# Altium project TAUV-Regulated_Power.PrjPcb (part 2 of 2)

## Sheet Sht3-V12P0_reg.SchDoc
size C; SheetNumber: 3; SheetTotal: 4
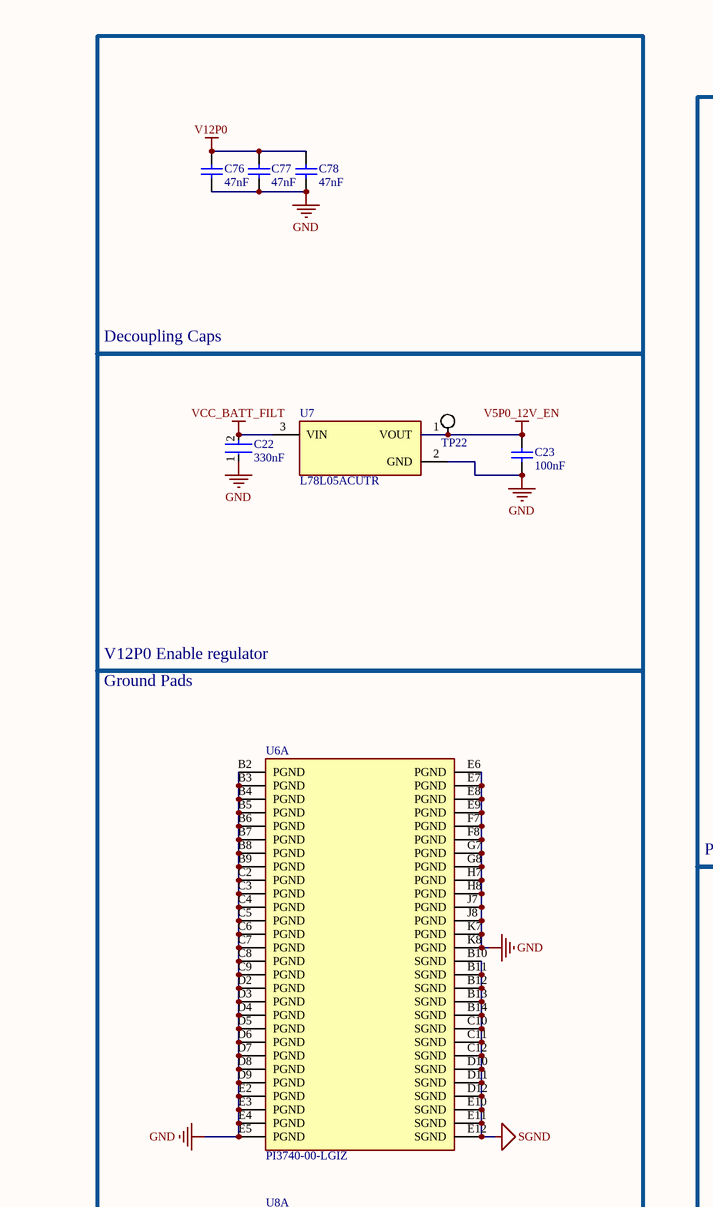
[diagram p5: Sht3-V12P0_reg.SchDoc, top left]
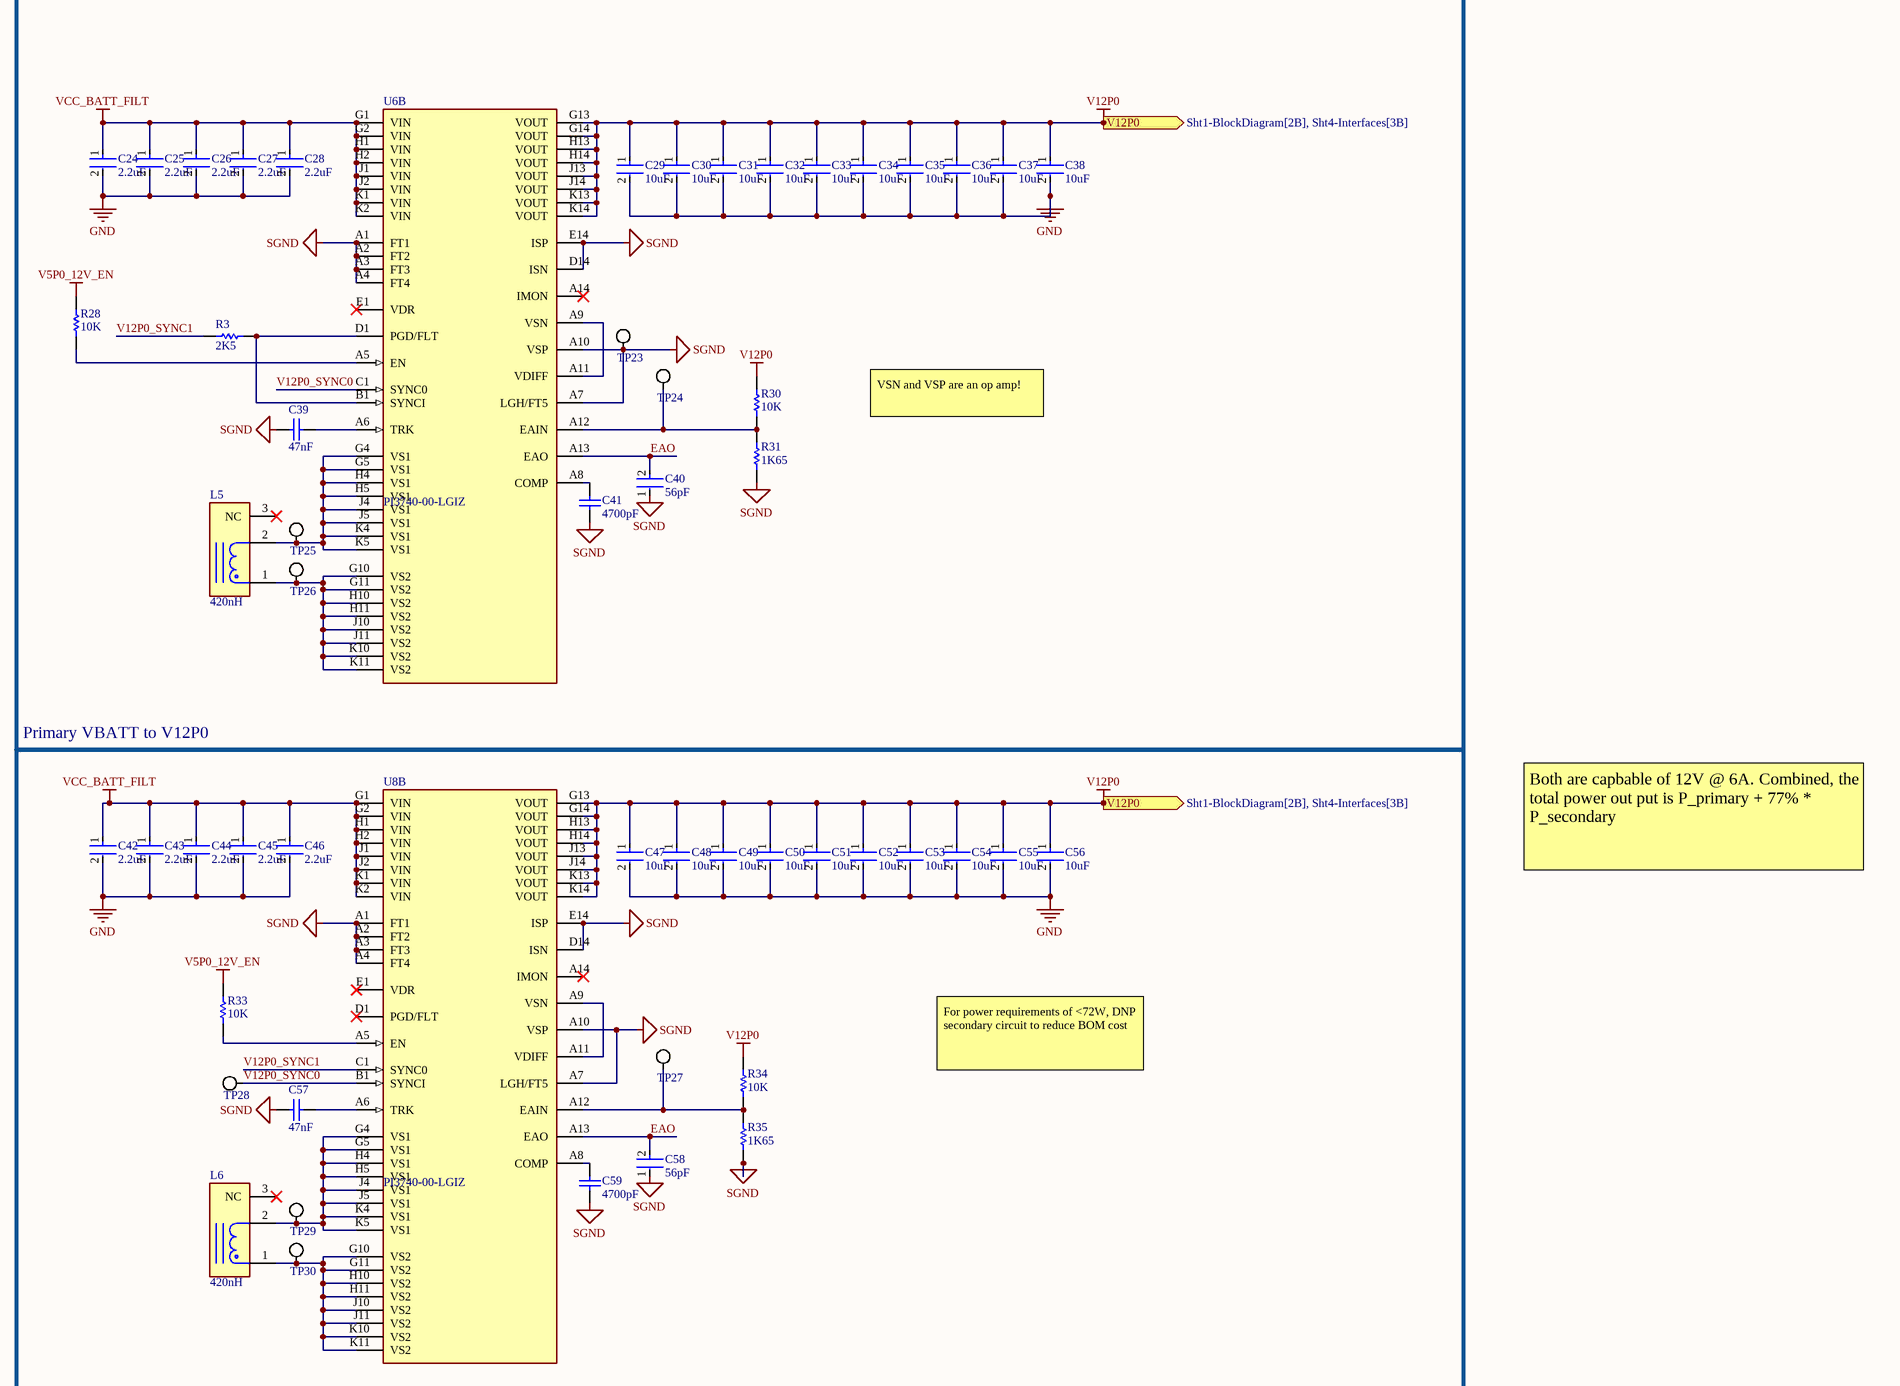
[diagram p6: Sht3-V12P0_reg.SchDoc, top right]
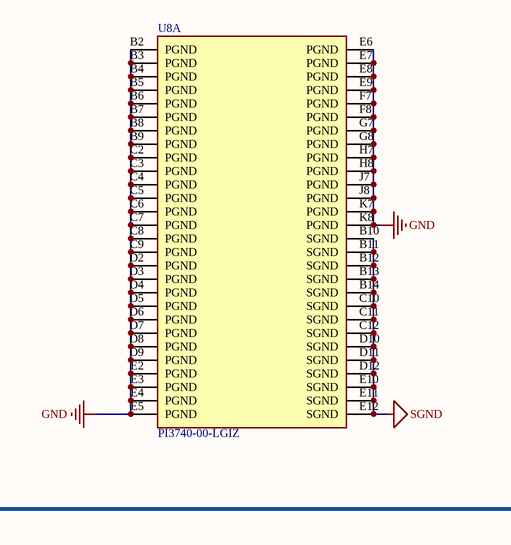
[diagram p7: Sht3-V12P0_reg.SchDoc, bottom left]
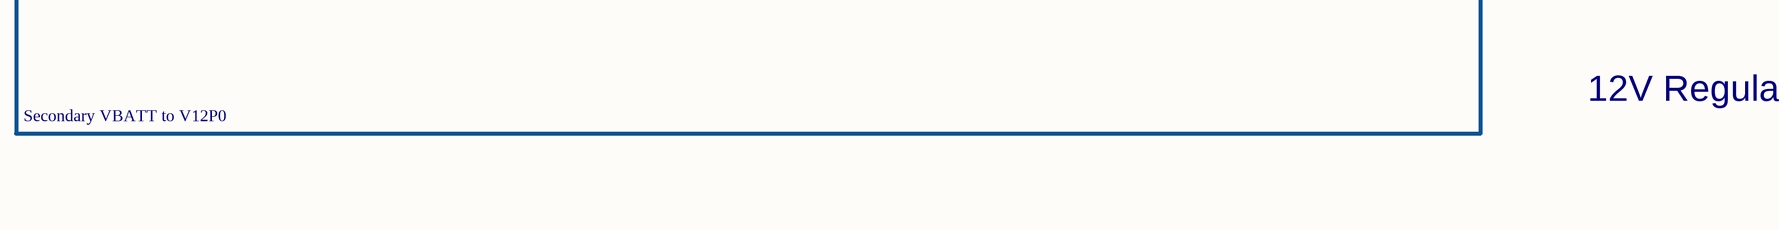
[diagram p8: Sht3-V12P0_reg.SchDoc, bottom right]

### Parts
C22  330nF  [FP-C1608-080-0_1-IPC_A]
C23  100nF  [CAPC0603(1608)100_L]
C24  2.2uF  [FP-1210-L_3_3_0_4-W_2_5_0-IPC_B]
C25  2.2uF  [FP-1210-L_3_3_0_4-W_2_5_0-IPC_B]
C26  2.2uF  [FP-1210-L_3_3_0_4-W_2_5_0-IPC_B]
C27  2.2uF  [FP-1210-L_3_3_0_4-W_2_5_0-IPC_B]
C28  2.2uF  [FP-1210-L_3_3_0_4-W_2_5_0-IPC_B]
C29  10uF  [FP-GRM32-MFG]
C30  10uF  [FP-GRM32-MFG]
C31  10uF  [FP-GRM32-MFG]
C32  10uF  [FP-GRM32-MFG]
C33  10uF  [FP-GRM32-MFG]
C34  10uF  [FP-GRM32-MFG]
C35  10uF  [FP-GRM32-MFG]
C36  10uF  [FP-GRM32-MFG]
C37  10uF  [FP-GRM32-MFG]
C38  10uF  [FP-GRM32-MFG]
C39  47nF  [CAPC1608X90X35LL10T15]
C40  56pF  [FP-C1608-080-0_1-IPC_C]
C41  4700pF  [CAPC1608X90X35ML10T15]
C42  2.2uF  [FP-1210-L_3_3_0_4-W_2_5_0-IPC_B]
C43  2.2uF  [FP-1210-L_3_3_0_4-W_2_5_0-IPC_B]
C44  2.2uF  [FP-1210-L_3_3_0_4-W_2_5_0-IPC_B]
C45  2.2uF  [FP-1210-L_3_3_0_4-W_2_5_0-IPC_B]
C46  2.2uF  [FP-1210-L_3_3_0_4-W_2_5_0-IPC_B]
C47  10uF  [FP-GRM32-MFG]
C48  10uF  [FP-GRM32-MFG]
C49  10uF  [FP-GRM32-MFG]
C50  10uF  [FP-GRM32-MFG]
C51  10uF  [FP-GRM32-MFG]
C52  10uF  [FP-GRM32-MFG]
C53  10uF  [FP-GRM32-MFG]
C54  10uF  [FP-GRM32-MFG]
C55  10uF  [FP-GRM32-MFG]
C56  10uF  [FP-GRM32-MFG]
C57  47nF  [CAPC1608X90X35LL10T15]
C58  56pF  [FP-C1608-080-0_1-IPC_C]
C59  4700pF  [CAPC1608X90X35ML10T15]
C76  47nF  [CAPC1608X90X35LL10T15]
C77  47nF  [CAPC1608X90X35LL10T15]
C78  47nF  [CAPC1608X90X35LL10T15]
L5  420nH  [FP-HCV1206-R42-R-MFG]
L6  420nH  [FP-HCV1206-R42-R-MFG]
R3  2K5  [RESC1608X55X25NL10T15]
R28  10K  [RESC1609X50X30NL8T20]
R30  10K  [RESC1609X50X30NL8T20]
R31  1K65  [RESC1608X55X25ML10T15]
R33  10K  [RESC1609X50X30NL8T20]
R34  10K  [RESC1609X50X30NL8T20]
R35  1K65  [RESC1608X55X25ML10T15]
TP22  (no value)  [Test Point Pad]
TP23  (no value)  [Test Point Pad]
TP24  (no value)  [Test Point Pad]
TP25  (no value)  [Test Point Pad]
TP26  (no value)  [Test Point Pad]
TP27  (no value)  [Test Point Pad]
TP28  (no value)  [Test Point Pad]
TP29  (no value)  [Test Point Pad]
TP30  (no value)  [Test Point Pad]
U6  PI3740-00-LGIZ  [FP-PI3740-00-LGIZ-MFG]  (parts A,B of 2)
U7  L78L05ACUTR  [FP-SOT-89-7098166-MFG]
U8  PI3740-00-LGIZ  [FP-PI3740-00-LGIZ-MFG]  (parts A,B of 2)

### Blocks framed on the sheet
Decoupling Caps: C76-C78
Primary VBATT to V12P0: C24-C41 L5 R3 R28 R30 R31 TP23-TP26 U6
Secondary VBATT to V12P0: C42-C59 L6 R33-R35 TP27-TP30 U8

### Ports
V12P0 (out, see Sht1-BlockDiagram[2B], Sht4-Interfaces[3B])

### Nets
GND: C22.1 C23.2 C24.2 C25.2 C26.2 C27.2 C28.2 C29.2 C30.2 C31.2 C32.2 C33.2 C34.2 C35.2 C36.2 C37.2 C38.2 C42.2 C43.2 C44.2 C45.2 C46.2 C47.2 C48.2 C49.2 C50.2 C51.2 C52.2 C53.2 C54.2 C55.2 C56.2 C76.2 C77.2 C78.2 U6.B2(PGND) U6.B3(PGND) U6.B4(PGND) U6.B5(PGND) U6.B6(PGND) U6.B7(PGND) U6.B8(PGND) U6.B9(PGND) U6.C2(PGND) U6.C3(PGND) U6.C4(PGND) U6.C5(PGND) U6.C6(PGND) U6.C7(PGND) U6.C8(PGND) U6.C9(PGND) U6.D2(PGND) U6.D3(PGND) U6.D4(PGND) U6.D5(PGND) U6.D6(PGND) U6.D7(PGND) U6.D8(PGND) U6.D9(PGND) U6.E2(PGND) U6.E3(PGND) U6.E4(PGND) U6.E5(PGND) U6.E6(PGND) U6.E7(PGND) U6.E8(PGND) U6.E9(PGND) U6.F7(PGND) U6.F8(PGND) U6.G7(PGND) U6.G8(PGND) U6.H7(PGND) U6.H8(PGND) U6.J7(PGND) U6.J8(PGND) U6.K7(PGND) U6.K8(PGND) U7.2(GND) U8.B2(PGND) U8.B3(PGND) U8.B4(PGND) U8.B5(PGND) U8.B6(PGND) U8.B7(PGND) U8.B8(PGND) U8.B9(PGND) U8.C2(PGND) U8.C3(PGND) U8.C4(PGND) U8.C5(PGND) U8.C6(PGND) U8.C7(PGND) U8.C8(PGND) U8.C9(PGND) U8.D2(PGND) U8.D3(PGND) U8.D4(PGND) U8.D5(PGND) U8.D6(PGND) U8.D7(PGND) U8.D8(PGND) U8.D9(PGND) U8.E2(PGND) U8.E3(PGND) U8.E4(PGND) U8.E5(PGND) U8.E6(PGND) U8.E7(PGND) U8.E8(PGND) U8.E9(PGND) U8.F7(PGND) U8.F8(PGND) U8.G7(PGND) U8.G8(PGND) U8.H7(PGND) U8.H8(PGND) U8.J7(PGND) U8.J8(PGND) U8.K7(PGND) U8.K8(PGND)
SGND: C39.2 C40.1 C41.2 C57.1 C58.1 C59.2 R31.1 R35.1 TP23.1 U6.A1(FT1) U6.A2(FT2) U6.A3(FT3) U6.A4(FT4) U6.A7(LGH/FT5) U6.A10(VSP) U6.B10(SGND) U6.B11(SGND) U6.B12(SGND) U6.B13(SGND) U6.B14(SGND) U6.C10(SGND) U6.C11(SGND) U6.C12(SGND) U6.D10(SGND) U6.D11(SGND) U6.D12(SGND) U6.D14(ISN) U6.E10(SGND) U6.E11(SGND) U6.E12(SGND) U6.E14(ISP) U8.A1(FT1) U8.A2(FT2) U8.A3(FT3) U8.A4(FT4) U8.A7(LGH/FT5) U8.A10(VSP) U8.B10(SGND) U8.B11(SGND) U8.B12(SGND) U8.B13(SGND) U8.B14(SGND) U8.C10(SGND) U8.C11(SGND) U8.C12(SGND) U8.D10(SGND) U8.D11(SGND) U8.D12(SGND) U8.D14(ISN) U8.E10(SGND) U8.E11(SGND) U8.E12(SGND) U8.E14(ISP)
V5P0_12V_EN: C23.1 R28.2 R33.2 TP22.1 U7.1(VOUT)
V12P0: C29.1 C30.1 C31.1 C32.1 C33.1 C34.1 C35.1 C36.1 C37.1 C38.1 C47.1 C48.1 C49.1 C50.1 C51.1 C52.1 C53.1 C54.1 C55.1 C56.1 C76.1 C77.1 C78.1 R30.2 R34.2 U6.G13(VOUT) U6.G14(VOUT) U6.H13(VOUT) U6.H14(VOUT) U6.J13(VOUT) U6.J14(VOUT) U6.K13(VOUT) U6.K14(VOUT) U8.G13(VOUT) U8.G14(VOUT) U8.H13(VOUT) U8.H14(VOUT) U8.J13(VOUT) U8.J14(VOUT) U8.K13(VOUT) U8.K14(VOUT) ; port V12P0
VCC_BATT_FILT: C22.2 C24.1 C25.1 C26.1 C27.1 C28.1 C42.1 C43.1 C44.1 C45.1 C46.1 U6.G1(VIN) U6.G2(VIN) U6.H1(VIN) U6.H2(VIN) U6.J1(VIN) U6.J2(VIN) U6.K1(VIN) U6.K2(VIN) U7.3(VIN) U8.G1(VIN) U8.G2(VIN) U8.H1(VIN) U8.H2(VIN) U8.J1(VIN) U8.J2(VIN) U8.K1(VIN) U8.K2(VIN)
EAO: C40.2 C58.2 U6.A13(EAO) U8.A13(EAO)
V12P0_SYNC0: TP28.1 U6.C1(SYNC0) U8.B1(SYNCI)
V12P0_SYNC1: R3.1 U8.C1(SYNC0)
NetC39_1: C39.1 U6.A6(TRK)
NetC41_1: C41.1 U6.A8(COMP)
NetC57_2: C57.2 U8.A6(TRK)
NetC59_1: C59.1 U8.A8(COMP)
NetL5_1: L5.1 TP26.1 U6.G10(VS2) U6.G11(VS2) U6.H10(VS2) U6.H11(VS2) U6.J10(VS2) U6.J11(VS2) U6.K10(VS2) U6.K11(VS2)
NetL5_2: L5.2 TP25.1 U6.G4(VS1) U6.G5(VS1) U6.H4(VS1) U6.H5(VS1) U6.J4(VS1) U6.J5(VS1) U6.K4(VS1) U6.K5(VS1)
NetL6_1: L6.1 TP30.1 U8.G10(VS2) U8.G11(VS2) U8.H10(VS2) U8.H11(VS2) U8.J10(VS2) U8.J11(VS2) U8.K10(VS2) U8.K11(VS2)
NetL6_2: L6.2 TP29.1 U8.G4(VS1) U8.G5(VS1) U8.H4(VS1) U8.H5(VS1) U8.J4(VS1) U8.J5(VS1) U8.K4(VS1) U8.K5(VS1)
NetR3_2: R3.2 U6.B1(SYNCI) U6.D1(PGD/FLT)
NetR28_1: R28.1 U6.A5(EN)
NetR30_1: R30.1 R31.2 TP24.1 U6.A12(EAIN)
NetR33_1: R33.1 U8.A5(EN)
NetR34_1: R34.1 R35.2 TP27.1 U8.A12(EAIN)
NetU6_A9: U6.A9(VSN) U6.A11(VDIFF)
NetU8_A9: U8.A9(VSN) U8.A11(VDIFF)

Not connected (* = marked no-connect by the designer): L5 3(NC)*; L6 3(NC)*; U6 A14(IMON)* E1(VDR)*; U8 A14(IMON)* D1(PGD/FLT)* E1(VDR)*

### Notes on the sheet
- VSN and VSP are an op amp!
- V12P0 Enable regulator
- Ground Pads
- Both are capbable of 12V @ 6A. Combined, the total power out put is P_primary + 77% * P_secondary
- For power requirements of <72W, DNP secondary circuit to reduce BOM cost
- 12V Regulators

### Library data of the parts
C22 = 330nF 0603: Multilayer Ceramic Capacitors 330nF ±10% 50V X7R SMD 0603; Capacitance: 330nF; Case Code (Imperial): 0603; Case Code (Metric): 1608; Dielectric: X7R; Length: 1.6mm; Construction: Flat; Resistor Type: Ceramic; Mount: Surface Mount; Voltage Rating: 50V; Packaging: Tape and Reel; Series: C; Case/Package: 0603; Lead Free: Lead Free; Tolerance: 10%; Voltage: 50V; REACH SVHC: No SVHC; Height: 0.8mm; Weight: 7.1E-05oz; Termination: SMD/SMT; Max Operating Temperature: 125°C; RoHS Compliant: Yes; Min Operating Temperature: -55°C; Depth: 0.8mm; Package Quantity: 1; Thickness: 0.037inch; Voltage Rating (DC): 50V; Dielectric Material: Ceramic; Width: 0.031inch; ComponentLink1Description: Link; ComponentLink1URL: https://www.digikey.com/en/products/detail/tdk-corporation/C1608X7R1H334K080AC/2443428
C23 = 100nF 0603: CAP 100nF 100V ±10% 0603 (1608 Metric) Thickness 1mm SMD; Tolerance: Â±10%; Case-EIA: 0603; Case-Metric: 1608; Rated Voltage: 100 V; Value: 100nF; Technology: SMT; Max Thickness: 1 mm; ComponentLink1Description: Link; ComponentLink1URL: https://www.digikey.com/en/products/detail/samsung-electro-mechanics/CL10B104KC8NNNC/5961291
C24-C28 C42-C46 = 2.2uF 1210: General Purpose Ceramic Capacitor, 1210, 2.2uF, 10%, X7R, 15%, 100V; Dissipation Factor: 2.5%; Number of Pins: 2; Lead Free: Lead Free; Voltage Rating: 100V; Min Operating Temperature: -55°C; Height: 2.79mm; Length: 3.2mm; Capacitance: 2.2uF; RoHS Compliant: Yes; Case/Package: 1210; Max Operating Temperature: 125°C; Radiation Hardening: No; Series: -; Case Code (Metric): 3225; Dielectric: X7R; Voltage Rating (DC): 100V; Packaging: Tape and Reel; Width: 2.5mm; Thickness: 0.11inch; Depth: 2.5mm; Contact Plating: Tin; REACH SVHC: No SVHC; Tolerance: 10%; Construction: Flat; Case Code (Imperial): 1210; Mount: Surface Mount; Package Quantity: 1; Termination: SMD/SMT; Voltage: 100V; ComponentLink1Description: Link; ComponentLink1URL: https://www.digikey.com/en/products/detail/samsung-electro-mechanics/CL32B225KCJSNNE/3889020
C29-C38 C47-C56 = 10uF 1210: CAP CER 10UF 50V X7R 1210; Manufacturer Part Number: GRM32ER71H106KA12L; Manufacturer: Murata; Tolerance: 10%; Material: Ceramic; Temperature Coefficient: 15%; Voltage Rating: 50V; Temperature Characteristic: X7R; Value: 10uF; ComponentLink2Description: Datasheet; Device Class L1: Passive Components; Lead Free: Yes; Temperature Range High: +125°C; Category: Cap; ComponentLink2URL: https://search.murata.co.jp/Ceramy/image/img/A01X/G101/ENG/GRM32ER71H106KA12-01.pdf; Device Class L2: Capacitors; Package: GRM32; Mouser Description: 1210 10 uF 50 V ±10% Tolerance X7R SMT Multilayer Ceramic Capacitor; Capacitance: 10uF; Octopart: https://octopart.com/grm32er71h106ka12l-murata-10470987; Digikey Description: CAP CER 10UF 50V X7R 1210; Height: 2.7mm; Temperature: -55°C to +125°C; Temperature Range Low: -55°C; RoHS: TRUE; Device Class L3: Ceramic Capacitors; Automotive: No; ComponentLink3Description: Link; ComponentLink3URL: https://www.digikey.com/en/products/detail/samsung-electro-mechanics/CL32B106KBJNNNE/3889045
C39 C57 C76-C78 = 47nF 0603: Manufacturer: Murata; Part Number: GRM188R71E473KA01D; ComponentLink1Description: Link; ComponentLink1URL: https://www.digikey.com/en/products/detail/kemet/C0603X473J4RECAUTO7411/8654446
C40 C58 = 56pF 0603: Multilayer Ceramic Capacitors 56pF ±5% 50V C0G SMD 0603; Voltage Rating (DC): 50V; Lead Free: Lead Free; Termination: SMD/SMT; Min Operating Temperature: -55°C; Dielectric: C0G; Dielectric Material: Ceramic; Packaging: Tape and Reel; REACH SVHC: No SVHC; Case Code (Imperial): 0603; Package Quantity: 1; Case/Package: 0603; Tolerance: 5%; Mount: Surface Mount; Depth: 0.8mm; Series: C; Construction: Flat; Max Operating Temperature: 125°C; RoHS Compliant: Yes; Thickness: 0.037inch; Radiation Hardening: No; Width: 0.031inch; Height: 0.8mm; Capacitance: 56pF; Voltage Rating: 50V; Weight: 7.1E-05oz; Case Code (Metric): 1608; Length: 1.6mm; ComponentLink1Description: Link; ComponentLink1URL: https://www.digikey.com/en/products/detail/samsung-electro-mechanics/CL10C560JB8NNNC/3886855
C41 C59 = 4700pF 0603: Part Number: GRM188R72A472KA01D; Manufacturer: Murata; ComponentLink1Description: Link; ComponentLink1URL: https://www.digikey.com/en/products/detail/walsin-technology-corporation/0603B472J500CT/9354937
L5 L6 = HCV1206-R42-R: HCV1206-R42-R -FIXED IND 420NH 16A 3.15 MOHM; Shielding: Unshielded; Tolerance: 10%; DC Resistance (DCR): 3.15mR; Core Material: Ferrite; Saturation Current: 42A; Test Frequency: 100kHz; Mount: Surface Mount; Length: 0.48inch; Width: 0.386inch; Resistor Type: Wirewound; RoHS Compliant: Yes; Packaging: Tape and Reel; Min Operating Temperature: -55°C; Case/Package: Nonstandard; Height - Seated (Max): 0.201inch; Max Operating Temperature: 125°C; Current Rating: 16A; Lead Free: Lead Free; Inductance: 420nH; ComponentLink1Description: Link; ComponentLink1URL: https://www.digikey.com/en/products/detail/eaton-electronics-division/HCV1206-R42-R/5418747
R3 = 2K5 0603: 2.5K 0603; Manufacturer: Yageo; Part Number: RC0603FR-072K55L; ComponentLink1Description: Link; ComponentLink1URL: https://www.digikey.com/en/products/detail/yageo/RC0603FR-072K55L/727029
R28 R30 R33 R34 = 10K 0603: Chip Resistor, 10 KOhm, +/- 1%, 100 mW, -55 to 155 degC, 0603 (1608 Metric), RoHS, Tape and Reel; Manufacturer: Vishay Semiconductor; Voltage Rating: 75 V; Max Operating Temperature: 155 degC; PackageDescription: 2-Pin Surface Mount Device, Body 1.575 x 0.85 mm; ComponentLink1Description: Manufacturer URL; RoHSCompliant: true; PackageReference: 0603; REACH SVHC: Unknown; Length: 1.55 mm; DatasheetVersion: 06/2012; Packaging: Tape and Reel; Min Operating Temperature: -55 degC; Mounting Technology: Surface Mount; ComponentLink2URL: https://datasheet.ciiva.com/11809/0900766b80d98afc-11809037.pdf; Height: 0.45 mm; ComponentLink2Description: Datasheet; Package Quantity: 5000; ComponentLink1URL: http://www.vishay.com/; ComponentLink3Description: Link; ComponentLink3URL: https://www.digikey.com/en/products/detail/stackpole-electronics-inc/RNCP0603FTD10K0/2240139
R31 R35 = 1K65 0603: 1.65k 0603; Part Number: RC0603FR-071K65L; Manufacturer: Yageo; ComponentLink1Description: Link; ComponentLink1URL: https://www.digikey.com/en/products/detail/yageo/RC0603FR-071K65L/726870
TP22-TP30 = Test Point Pad: Test point, Pad, 28 mil
U6 U8 = PI3740-00-LGIZ: DC DC CONVERTER 10-50V; Max Output Current: 6.5A; Max Input Voltage: 60V; Voltage - Output 1: 50V; Min Input Voltage: 8V; Efficiency: 96%; Number of Outputs: 1; Max Operating Temperature: 115°C; Features: UVLO; Series: Cool-Power® (140W); RoHS Compliant: Yes; Min Operating Temperature: -40°C; Mount: Surface Mount; Case/Package: LGA; Packaging: Tray; ComponentLink1Description: Link; ComponentLink1URL: https://www.digikey.com/en/products/detail/vicor-corporation/PI3740-00-LGIZ/6573281
U7 = L78L05ACUTR: IC REG LINEAR 5V 100MA SOT89-3; Output Voltage Accuracy: 4%; Number of Regulators: 1; Polarity: Positive; Quiescent Current: 6mA; Min Input Voltage: 7V; Power Supply Rejection Ratio (PSRR): 49dB; Output Type: Fixed; Max Input Voltage: 30V; Dropout Voltage: 1.7V; Nominal Output Voltage: 5V; Radiation Hardening: No; Number of Pins: 3; Weight: 0.004603oz; Output Current: 100mA; Width: 2.6mm; Packaging: Tape and Reel; Output Voltage: 5V; Length: 4.6mm; Max Output Current: 100mA; Min Operating Temperature: 0°C; Package Quantity: 1; Accuracy: 4%; Case/Package: SOT-89; Lead Free: Lead Free; Height: 1.6mm; Min Output Voltage: 5V; Contact Plating: Tin; Number of Outputs: 1; REACH SVHC: No SVHC; Mount: Surface Mount; Max Operating Temperature: 125°C; ComponentLink1Description: Link; ComponentLink1URL: https://www.digikey.com/en/products/detail/stmicroelectronics/L78L05ACUTR/585707?s=N4IgTCBcDaIDIHYAccAMBWAggYQKoBUAlEAXQF8g

## Sheet Sht2-Regulators.SchDoc
size B; SheetNumber: 2; SheetTotal: 4
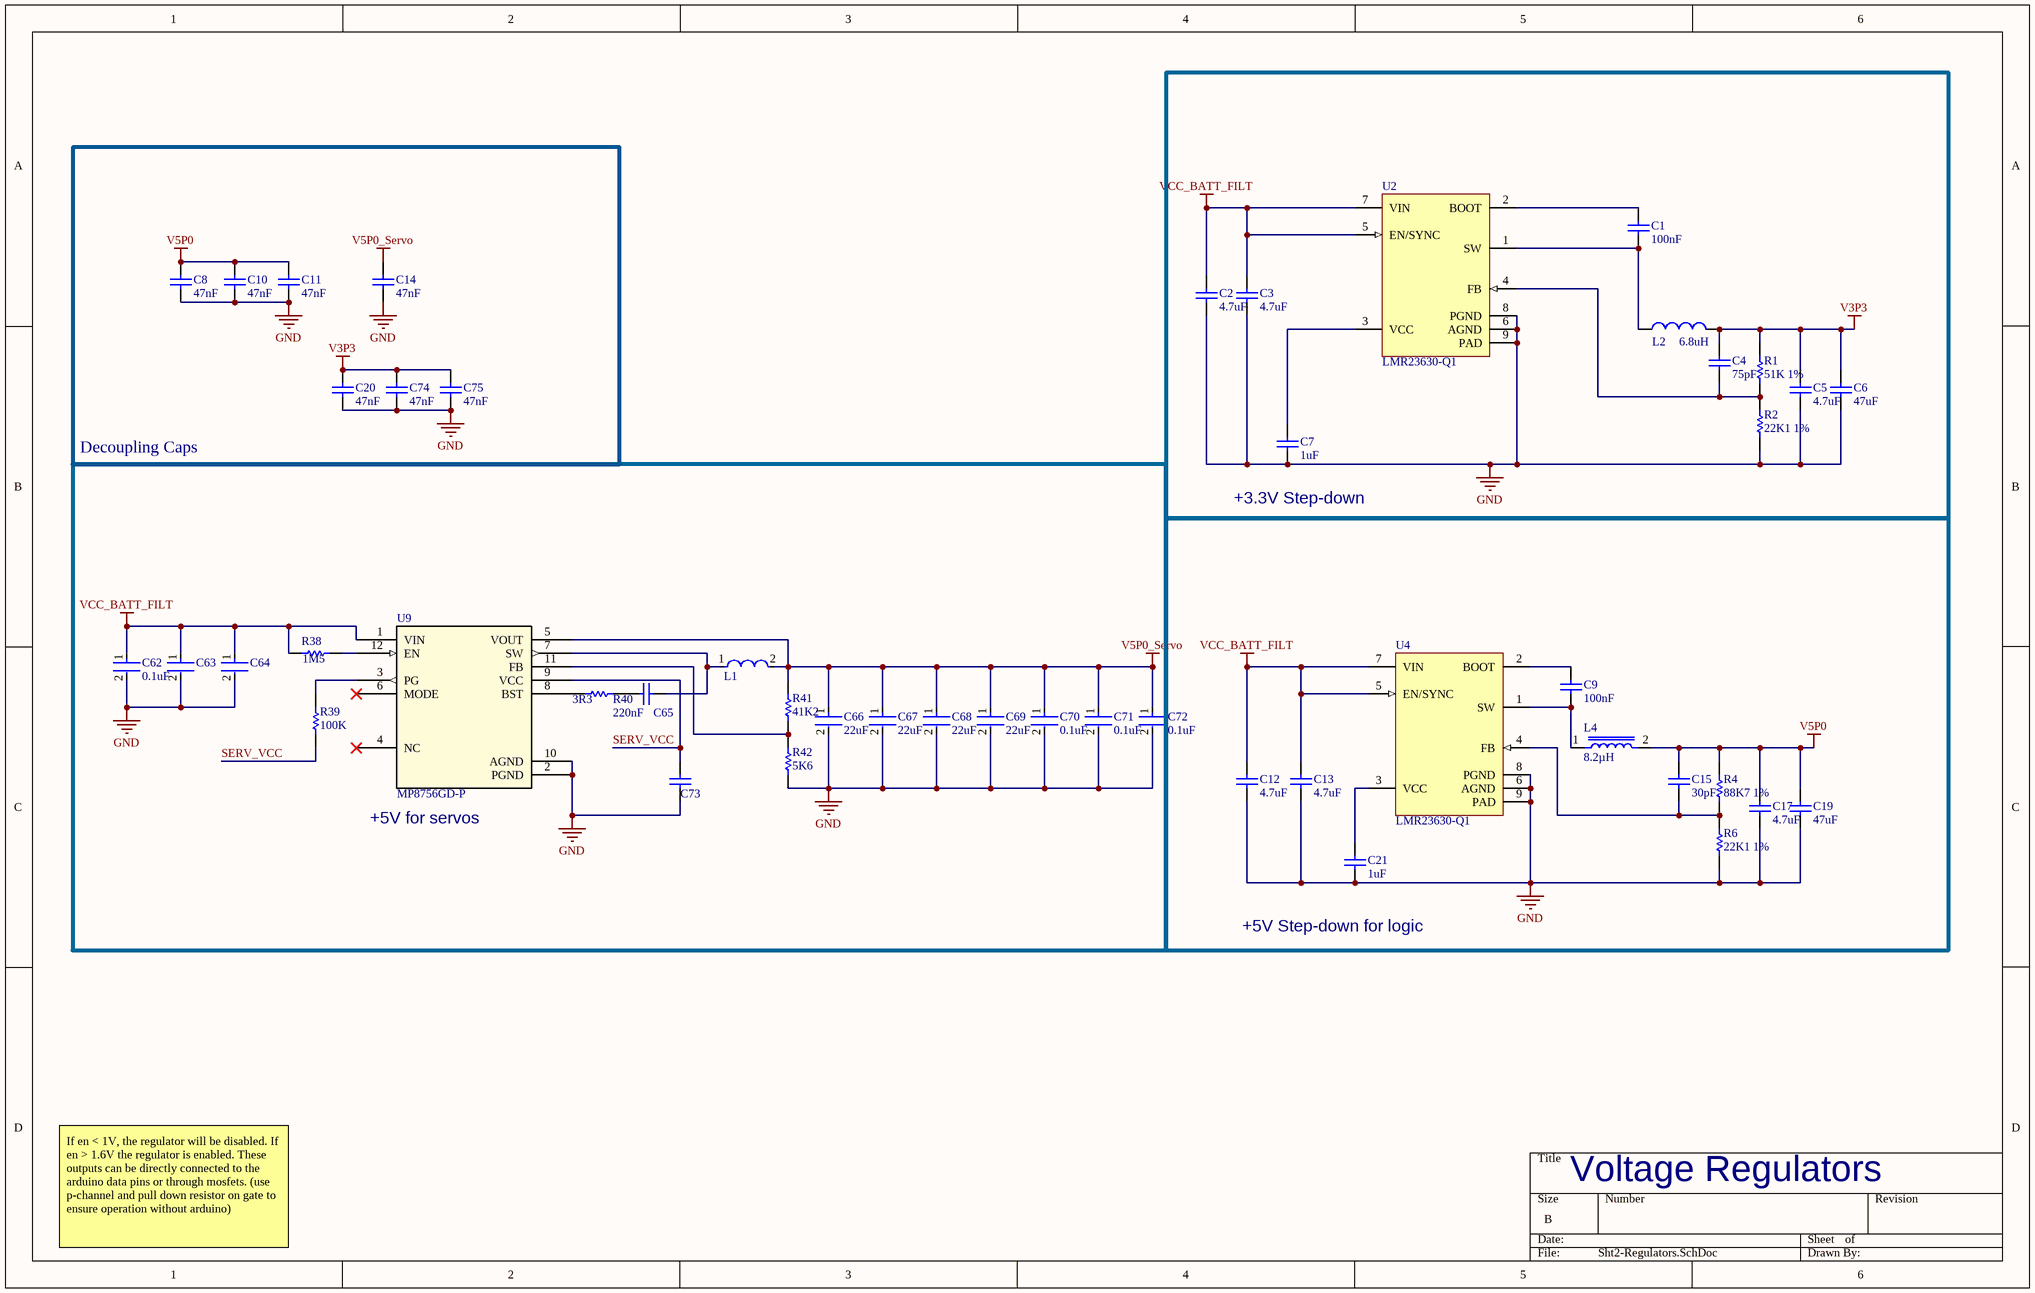
[diagram p9: Sht2-Regulators.SchDoc]

### Parts
(Parts that share a designator on the sheet are numbered #1, #2 ... from top to bottom, then left to right.)
C1  100nF  [CAPC0603(1608)100_L]
C2  4.7uF  [CAPC1206(3216)190_L]
C3  4.7uF  [CAPC1206(3216)190_L]
C4  75pF  [CAPC0603(1608)100_L]
C5  4.7uF  [CAPC1206(3216)190_L]
C6  47uF  [CAPC1206(3216)190_L]
C7  1uF  [CAPC0603(1608)100_L]
C8  47nF  [CAPC1608X90X35LL10T15]
C9  100nF  [CAPC0603(1608)100_L]
C10  47nF  [CAPC1608X90X35LL10T15]
C11  47nF  [CAPC1608X90X35LL10T15]
C12  4.7uF  [CAPC1206(3216)190_L]
C13  4.7uF  [CAPC1206(3216)190_L]
C14  47nF  [CAPC1608X90X35LL10T15]
C15  30pF  [0603]
C17  4.7uF  [CAPC1206(3216)190_L]
C19  47uF  [CAPC1206(3216)190_L]
C20  47nF  [CAPC1608X90X35LL10T15]
C21  1uF  [CAPC0603(1608)100_L]
C62  0.1uF  [FP-CC0603-DA-MFG]
C63  (no value)  [0603]
C64  (no value)  [0603]
C65  220nF  [CAPC1608X87X35NL15T15]
C66  22uF  [0603]
C67  22uF  [0603]
C68  22uF  [0603]
C69  22uF  [0603]
C70  0.1uF  [FP-CC0603-DA-MFG]
C71  0.1uF  [FP-CC0603-DA-MFG]
C72  0.1uF  [FP-CC0603-DA-MFG]
C73  (no value)  [0603]
C74  47nF  [CAPC1608X90X35LL10T15]
C75  47nF  [CAPC1608X90X35LL10T15]
L1  (no value)  [FP-IHLP-2525CZ-FP_2_413x3-MFG]
L2  6.8uH  [BOURNS SRP5030T]
L4  8.2µH  [IND_SRP6540-8R2M]
R1  51K 1%  [RESC0603(1608)_L]
R2  22K1 1%  [RESC0603(1608)_L]
R4  88K7 1%  [RESC0603(1608)_L]
R6  22K1 1%  [RESC0603(1608)_L]
R38  1M5  [RESC1609X50X30NL10T20]
R39#2  100K  [0603]
R40#2  3R3  [RESC1608X55X30NL15T15]
R41  41K2  [RESC1608X55X30LL20T20]
R42  5K6  [RESC1609X55X30LL15T15]
U2  LMR23630-Q1  [DDA0008E_N]
U4  LMR23630-Q1  [DDA0008E_N]
U9#2  MP8756GD-P  [QFN-12_MP8756_MNP]

### Blocks framed on the sheet
+3.3V Step-down: C1-C7 L2 R1 R2 U2
Decoupling Caps: C8 C10 C11 C14 C20 C74 C75
+5V for servos: C62-C73 L1 R38 R39#2 R40#2 R41 R42 U9#2

### Nets
GND: C2.2 C3.2 C5.2 C6.2 C7.2 C8.2 C10.2 C11.2 C12.2 C13.2 C14.2 C17.2 C19.2 C20.2 C21.2 C62.2 C63.2 C64.2 C66.2 C67.2 C68.2 C69.2 C70.2 C71.2 C72.2 C73.1 C74.2 C75.2 R2.2 R6.2 R42.2 U2.6(AGND) U2.8(PGND) U2.9(PAD) U4.6(AGND) U4.8(PGND) U4.9(PAD) U9#2.2(PGND) U9#2.10(AGND)
V3P3: C4.1 C5.1 C6.1 C20.1 C74.1 C75.1 L2.2 R1.1
V5P0: C8.1 C10.1 C11.1 C15.1 C17.1 C19.1 L4.2 R4.1
V5P0_Servo: C14.1 C66.1 C67.1 C68.1 C69.1 C70.1 C71.1 C72.1 L1.2 R41.1 U9#2.5(VOUT)
VCC_BATT_FILT: C2.1 C3.1 C12.1 C13.1 C62.1 C63.1 C64.1 R38.1 U2.5(EN/SYNC) U2.7(VIN) U4.5(EN/SYNC) U4.7(VIN) U9#2.1(VIN)
SERV_VCC: C73.2 R39#2.2 U9#2.9(VCC)
NetC1_1: C1.1 U2.2(BOOT)
NetC1_2: C1.2 L2.1 U2.1(SW)
NetC4_2: C4.2 R1.2 R2.1 U2.4(FB)
NetC7_1: C7.1 U2.3(VCC)
NetC9_1: C9.1 U4.2(BOOT)
NetC9_2: C9.2 L4.1 U4.1(SW)
NetC15_2: C15.2 R4.2 R6.1 U4.4(FB)
NetC21_1: C21.1 U4.3(VCC)
NetC65_1: C65.1 R40#2.2
NetC65_2: C65.2 L1.1 U9#2.7(SW)
NetR38_2: R38.2 U9#2.12(EN)
NetR39#2_1: R39#2.1 U9#2.3(PG)
NetR40#2_1: R40#2.1 U9#2.8(BST)
NetR41_2: R41.2 R42.1 U9#2.11(FB)

Not connected (* = marked no-connect by the designer): U9#2 4(NC)* 6(MODE)*

### Notes on the sheet
- (near C21) +5V Step-down for logic
- If en < 1V, the regulator will be disabled. If en > 1.6V the regulator is enabled. These outputs can be directly connected to the arduino data pins or through mosfets. (use p-channel and pull down resistor on gate to ensure operation without arduino)
- Voltage Regulators

### Library data of the parts
C1 C9 = 100nF 0603: as C23 on sheet Sht3-V12P0_reg; Rated Voltage: 100 V; Value: 100nF; Technology: SMT; Max Thickness: 1 mm; ComponentLink1Description: Link; ComponentLink1URL: https://www.digikey.com/en/products/detail/samsung-electro-mechanics/CL10B104KC8NNNC/5961291
C2 C3 C5 C12 C13 C17 = 4.7uF 1206: CAP 4.7uF 35V ±10% 1206 (3216 Metric) Thickness 1.9mm SMD; Case-EIA: 1206; Tolerance: Â±10%; Case-Metric: 3216; Rated Voltage: 35 V; Technology: SMT; Value: 4.7uF; Max Thickness: 1.9 mm; ComponentLink1Description: Link; ComponentLink1URL: https://www.digikey.com/en/products/detail/samsung-electro-mechanics/CL31B475KBHNFNE/3888837
C4 = 75pF 0603: CAP 75pF 25V ±1% 0603 (1608 Metric) Thickness 1mm SMD; Case-Metric: 1608; Case-EIA: 0603; Tolerance: Â±1%; Rated Voltage: 25 V; Technology: SMT; Max Thickness: 1 mm; Value: 75pF; ComponentLink1Description: Link; ComponentLink1URL: https://www.digikey.com/en/products/detail/yageo/CC0603FRNPO9BN750/5883517
C6 C19 = 47uF 1206: CAP 47uF 16V ±20% 1206 (3216 Metric) Thickness 1.9mm SMD; Case-EIA: 1206; Tolerance: Â±20%; Case-Metric: 3216; Rated Voltage: 16 V; Technology: SMT; Value: 47uF; Max Thickness: 1.9 mm; ComponentLink1Description: Link; ComponentLink1URL: https://www.digikey.com/en/products/detail/taiyo-yuden/EMK316BBJ476ML-T/7067010
C7 C21 = 1uF 0603: CAP 1uF 25V ±10% 0603 (1608 Metric) Thickness 1mm SMD; Tolerance: Â±10%; Case-Metric: 1608; Case-EIA: 0603; Technology: SMT; Rated Voltage: 25 V; Max Thickness: 1 mm; Value: 1uF; ComponentLink1Description: Link; ComponentLink1URL: https://www.digikey.com/en/products/detail/samsung-electro-mechanics/CL10B105KA8NNNC/3886842
C8 C10 C11 C14 C20 C74 C75 = 47nF 0603: as C39 on sheet Sht3-V12P0_reg; ComponentLink1Description: Link; ComponentLink1URL: https://www.digikey.com/en/products/detail/kemet/C0603X473J4RECAUTO7411/8654446
C15 = 30pF 0603: CAP 30pF 50V ±10% 0603 (1608 Metric) Thickness 1mm SMD; Tolerance: Â±10%; Case-Metric: 1608; Rated Voltage: 50 V; Technology: SMT; Value: 30pF; Max Thickness: 1 mm; Case-EIA: 0603; ComponentLink1Description: Link; ComponentLink1URL: https://www.digikey.com/en/products/detail/stackpole-electronics-inc/CML0603C0G300JT50V/10659967
C62 C70-C72 = 0.1uF 0603: CC0603KRX7R9BB104-CAP CER 0.1UF 50V X7R 0603; Manufacturer: YAGEO; Material: Ceramic; Capacitance: 100 nF; Temperature Coefficient: 15%; Tolerance: 0.1; Value: 100 nF; Height: 0.9mm; Voltage: 50 V; ComponentLink2Description: Datasheet; Device Class L2: Capacitors; Temperature Range High: +125°C; Category: Cap; Footprint Url: http://www.yageo.com/exep/pages/download/literatures/UPY-C_GEN_24.pdf; ComponentLink2URL: http://www.yageo.com/documents/recent/UPY-GPHC_X7R_6.3V-to-50V_18.pdf; Package: CC0603-DA; Temperature: -55°C to +125°C; Voltage Rating: 50 V; Temperature Characteristic: X7R; Device Class L1: Passive Components; Temperature Range Low: -55°C; Manufacturer Part Number: CC0603KRX7R9BB104; RoHS: TRUE; Automotive: No; Device Class L3: Ceramic Capacitors; Octopart: https://octopart.com/cc0603krx7r9bb104-yageo-42244635; Mouser Description: Multilayer Ceramic Capacitor, CC Series, 0.1 - F, - 10%, X7R, 50 V, 0603 [1608 Metric]; Lead Free: Yes; Digikey Description: CAP CER 0.1UF 50V X7R 0603; ComponentLink3Description: Link; ComponentLink3URL: https://www.digikey.com/en/products/detail/samsung-electro-mechanics/CL10B104KB8NNWC/3887593
C63 C64 C66-C69 = 22uF 0603: Cap Ceramic 22uF 10V X5R ±20% Pad SMD 0603 +85°C T/R; Max Operating Temperature: 85°C; Packaging: Tape and Reel; Mount: Surface Mount; Width: 0.031inch; Length: 0.063inch; Min Operating Temperature: -55°C; Voltage Rating: 10V; Case/Package: 0603; Thickness: 0.037inch; Case Code (Metric): 1608; Tolerance: 20%; Case Code (Imperial): 0603; Capacitance: 22uF; ComponentLink1Description: Link; ComponentLink1URL: https://www.digikey.com/en/products/detail/samsung-electro-mechanics/CL10B224KB8VPNC/5961084
C65 = 220nF 0603: C0603C224K8NACTU-220nF 0603; Manufacturer: Kemet; Part Number: C0603C224K8NACTU; ComponentLink1Description: Link; ComponentLink1URL: https://www.digikey.com/en/products/detail/kemet/C0603C224K4RECAUTO/8640476
C73 = 1uF 0603: as C83 on sheet Sht4-Interfaces; Value: 1uF; Technology: SMT; Rated Voltage: 25 V; Case-EIA: 0603; Max Thickness: 1 mm; ComponentLink1Description: Link; ComponentLink1URL: https://www.digikey.com/en/products/detail/samsung-electro-mechanics/CL10B105KA8NNNC/3886842
L1 = 1.5uH 9A inductor: Commercial Inductors, High Saturation Series 1.5uH 9A 15mΩ 20%; DC Resistance (DCR): 15mR; Shielding: Shielded; Self Resonant Frequency: 5MHz; Max DC Current: 18A; Test Frequency: 100kHz; Core Material: Metal; Packaging: Tape and Reel; RMS Current (Irms): 9A; Length: 7.24mm; Case Code (Imperial): 2525; Case/Package: 2525; Min Operating Temperature: -55°C; Number of Pins: 2; Contact Plating: Tin; Height: 3mm; Height - Seated (Max): 0.118inch; Termination: SMD/SMT; Max Operating Temperature: 125°C; Depth: 6.72mm; Width: 6.47mm; Current Rating: 9A; Tolerance: 20%; Lead Free: Lead Free; Military Standard: Not; Radiation Hardening: No; Saturation Current: 18A; Package Quantity: 2000; Inductance Tolerance: 20%; Inductance: 1.5uH; Mount: Surface Mount; ComponentLink1Description: Link; ComponentLink1URL: https://www.digikey.com/en/products/detail/vishay-dale/IHLP2525CZER1R5M01/1220672
L2 = SRP5030TA: Manufacturer: Bourns Inc.; Manufacturer Part Number: SRP5030TA-6R8M; Type: Wirewound; Material - Core: Carbonyl Powder; Tolerance: ±20%; Shielding: Shielded; DC Resistance (DCR): 76.2 mOhm Max; Q @ Freq: 15 @ 100kHz; Supplier 1: Digi-Key; RoHS: RoHS Compliant; Category: Inductors, Coils, Chokes; Stock 1: 5626; Pricing 1: 1=1.51, 10=1.397, 100=0.9781, 500=0.79178, 1000=0.72191 (USD); Packaging: Cut Tape (CT); Part Status: Active; Ratings: AEC-Q200; Operating Temperature: -40°C ~ 150°C; Mounting Type: Surface Mount; Package / Case: Nonstandard; Supplier Device Package: -; Size / Dimension: 0.224" L x 0.205" W (5.70mm x 5.20mm); Height - Seated (Max): 0.118" (3.00mm); ComponentLink1URL: http://www.bourns.com/docs/Product-Datasheets/SRP5030TA.pdf; ComponentLink1Description: http://www.bourns.com/docs/Product-Datasheets/SRP5030TA.pdf; Supplier Part Number 1: SRP5030TA-6R8MCT-ND; ComponentLink2Description: Link; ComponentLink2URL: https://www.digikey.com/en/products/detail/bourns-inc/SRP5030TA-6R8M/5429675?s=N4IgjCBcoEwAwA4DsVQGMoDMCGAbAzgKYA0IA9lANogBsAdAgAQCtAEiALqkAOALlCACqAOwCWvAPKYAsoWz4ArgCdCIAL5rSMKiADKAJQAKAVjgBmOABUAgpzVA
L4 = SRP6540-8R2M: 8.2µH Shielded Wirewound Inductor 4.5A 50.5mOhm Max Nonstandard; MF: Bourns; ComponentLink1URL: https://www.digikey.com/en/products/detail/bourns-inc/SRP6540-8R2M/3986098?s=N4IgTCBcDaIMoCUAKA2ArAFgAwFoAcCYAsiALoC%2BQA; ComponentLink1Description: Link; MP: SRP6540-8R2M; Package: Nonstandard Bourns; Digi-Key_Part_Number: SRP6540-8R2MCT-ND; Purchase-URL: https://pricing.snapeda.com/search/part/SRP6540-8R2M/?ref=eda; SnapEDA_Link: https://www.snapeda.com/parts/SRP6540-8R2M/Bourns/view-part/1329449/?ref=snap; Value: *
R1 = 51K 0603: 51K 0.1W 1% 0603 (1608 Metric)  SMD; Case-EIA: 0603; Case-Metric: 1608; Value: 51000.00 Ohm; Tolerance: 1 %; Technology: SMT; Power: 0.1 W; ComponentLink1Description: Link; ComponentLink1URL: https://www.digikey.com/en/products/detail/panasonic-electronic-components/ERJ-PB3B5102V/6212949
R2 R6 = 22K1 0603: 22K1 0.1W 1% 0603 (1608 Metric)  SMD; Case-EIA: 0603; Case-Metric: 1608; Value: 22100.00 Ohm; Tolerance: 1 %; Power: 0.1 W; Technology: SMT; ComponentLink1Description: Link; ComponentLink1URL: https://www.digikey.com/en/products/detail/yageo/RC0603FR-0722K1L/727058
R4 = 88K7 0603: 88K7 0.1W 1% 0603 (1608 Metric)  SMD; Value: 88700.00 Ohm; Case-Metric: 1608; Case-EIA: 0603; Tolerance: 1 %; Power: 0.1 W; Technology: SMT; ComponentLink1Description: Link; ComponentLink1URL: https://www.digikey.com/en/products/detail/yageo/RC0603FR-0788K7L/727415
R38 = 1M5 0603: CRCW06031M50FKEA-1M5 0603; Manufacturer: Vishay Dale; Part Number: CRCW06031M50FKEA; ComponentLink1Description: Link; ComponentLink1URL: https://www.digikey.com/en/products/detail/yageo/RC0603FR-071M5L/726865
R39#2 = 100K 0603: ERJ-3EKF1003V-100k 0603; Manufacturer: Panasonic; Part Number: ERJ-3EKF1003V; ComponentLink1Description: Link; ComponentLink1URL: https://www.digikey.com/en/products/detail/yageo/RC0603FR-07100KL/726889
R40#2 = 3R3 0603: ERJ-3RQF3R3V- 3R3 0603; Manufacturer: Panasonic; Part Number: ERJ-3RQF3R3V; ComponentLink1Description: Link; ComponentLink1URL: https://www.digikey.com/en/products/detail/yageo/RC0603FR-133R3L/14008285
R41 = 41K2 0603: ERA3AEB4122V-41k2 0603; Manufacturer: Panasonic; Part Number: ERA3AEB4122V; ComponentLink1Description: Link; ComponentLink1URL: https://www.digikey.com/en/products/detail/yageo/RC0603FR-1041K2L/14008303
R42 = 5K6 0603: Chip Resistor, 5.6 KOhm, +/- 1%, 0.1 W, -55 to 155 degC, 0603 (1608 Metric), RoHS, Tape and Reel; Elements: 1; Max Power Dissipation: 625 mW; hFE Min: 100; Case\Package: TO-236-3; Frequency: 300 MHz; Vce Max: 300 mV; Packaging: Tape and Reel; PackageReference: 0603; RoHSCompliant: true; ComponentLink1URL: http://www.panasonic.com/; ComponentLink2Description: Datasheet; REACH SVHC: No SVHC; PackageDescription: 2-Pin Surface Mount Device, Body 1.6 x 0.85 mm; Mount: Surface Mount; Height: 0.25 inch; Max Operating Temperature: 150 degC; Min Operating Temperature: -55 degC; ComponentLink1Description: Manufacturer URL; Width: 0.25 inch; Package Quantity: 3000; Length: 0.25 inch; DatasheetVersion: Apr-15; Pins: 3; ComponentLink2URL: http://industrial.panasonic.com/cdbs/www-data/pdf/RDA0000/AOA0000C86.pdf; Weight: 0.002116 oz; Radiation Hardening: No; ComponentLink3Description: Link; ComponentLink3URL: https://www.digikey.com/en/products/detail/yageo/RC0603FR-135K6L/14286727
U2 U4 = LMR23630-Q1: Manufacturer: Texas Instruments; Manufacturer Part Number: LMR23630AFQDDARQ1; Function: Step-Down; Output Configuration: Positive; Topology: Buck; Output Type: Adjustable; Number of Outputs: 1; Voltage - Input (Min): 4.5V; Voltage - Input (Max): 36V; Voltage - Output (Min/Fixed): 1V; Voltage - Output (Max): 28V; Current - Output: 3A; Frequency - Switching: 400kHz; Synchronous Rectifier: Yes; Supplier 1: Digi-Key; RoHS: RoHS Compliant; Category: Integrated Circuits (ICs); Stock 1: 1636; Pricing 1: 1=3.97, 10=3.564, 100=2.9204, 500=2.48604, 1000=2.09667 (USD); Packaging: Digi-Reel®; Part Status: Active; Operating Temperature: -40°C ~ 125°C (TJ); Mounting Type: Surface Mount; Package / Case: 8-SOIC (0.154", 3.90mm Width) Exposed Pad; Supplier Device Package: 8-SO PowerPad; ComponentLink1URL: http://www.ti.com/lit/ds/symlink/lmr23630-q1.pdf; ComponentLink1Description: http://www.ti.com/lit/ds/symlink/lmr23630-q1.pdf; Supplier Part Number 1: 296-45260-6-ND; ComponentLink2Description: Link; ComponentLink2URL: https://www.digikey.com/en/products/detail/texas-instruments/LMR23630AQDDARQ1/6590816
U9#2 = MP8756GD-P: No Description Available; Mfr_Name: Monolithic Power Systems; RefDes: RefDes; Type: Type

## Nets that join several sheets
GND: Sht4-Interfaces (97 pins), Sht3-V12P0_reg (120 pins), Sht2-Regulators (39 pins)
V3P3: Sht4-Interfaces (11 pins), Sht2-Regulators (8 pins)
V5P0: Sht4-Interfaces (13 pins), Sht2-Regulators (8 pins)
V5P0_Servo: Sht4-Interfaces (P2.5 R10.1 R13.2 TP10.1), Sht2-Regulators (11 pins)
V12P0: Sht4-Interfaces (10 pins), Sht3-V12P0_reg (41 pins)
VCC_BATT_FILT: Sht4-Interfaces (12 pins), Sht3-V12P0_reg (28 pins), Sht2-Regulators (13 pins)